# EAGLE design sa-22c-microsemi-connector (EAGLE 9.5.2)
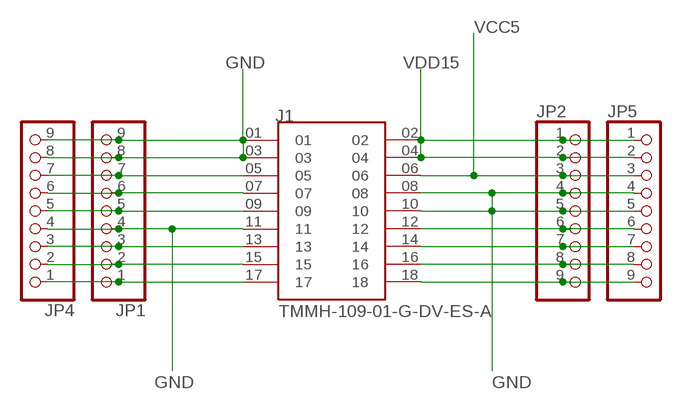
[diagram p0: schematic, sheet 1]

## Parts
J1  TMMH-109-01-G-DV-ES-A  [SAMTEC_TMMH-109-01-G-DV-ES-A]
JP1  PINHD-1X9  [1X09]
JP2  PINHD-1X9  [1X09]
JP4  PINHD-1X9  [1X09]
JP5  PINHD-1X9  [1X09]

## Nets
GND: J1.01 J1.03 J1.08 J1.10 J1.11 JP1.4 JP1.8 JP1.9 JP2.4 JP2.5 JP4.4 JP4.8 JP4.9 JP5.4 JP5.5
N$3: J1.05 JP1.7 JP4.7
N$4: J1.07 JP1.6 JP4.6
N$5: J1.09 JP1.5 JP4.5
N$7: J1.13 JP1.3 JP4.3
N$8: J1.15 JP1.2 JP4.2
N$9: J1.17 JP1.1 JP4.1
N$15: J1.12 JP2.6 JP5.6
N$16: J1.14 JP2.7 JP5.7
N$17: J1.16 JP2.8 JP5.8
N$18: J1.18 JP2.9 JP5.9
VCC5: J1.06 JP2.3 JP5.3
VDD15: J1.02 J1.04 JP2.1 JP2.2 JP5.1 JP5.2

## Library data of the parts
J1 = TMMH-109-01-G-DV-ES-A:TMMH-109-01-G-DV-ES-A; MANUFACTURER: Samtec; PARTREV: R; STANDARD: Manufacturer Recommendations
JP1 JP2 JP4 JP5 = pinhead:PINHD-1X9: PIN HEADER

## Board
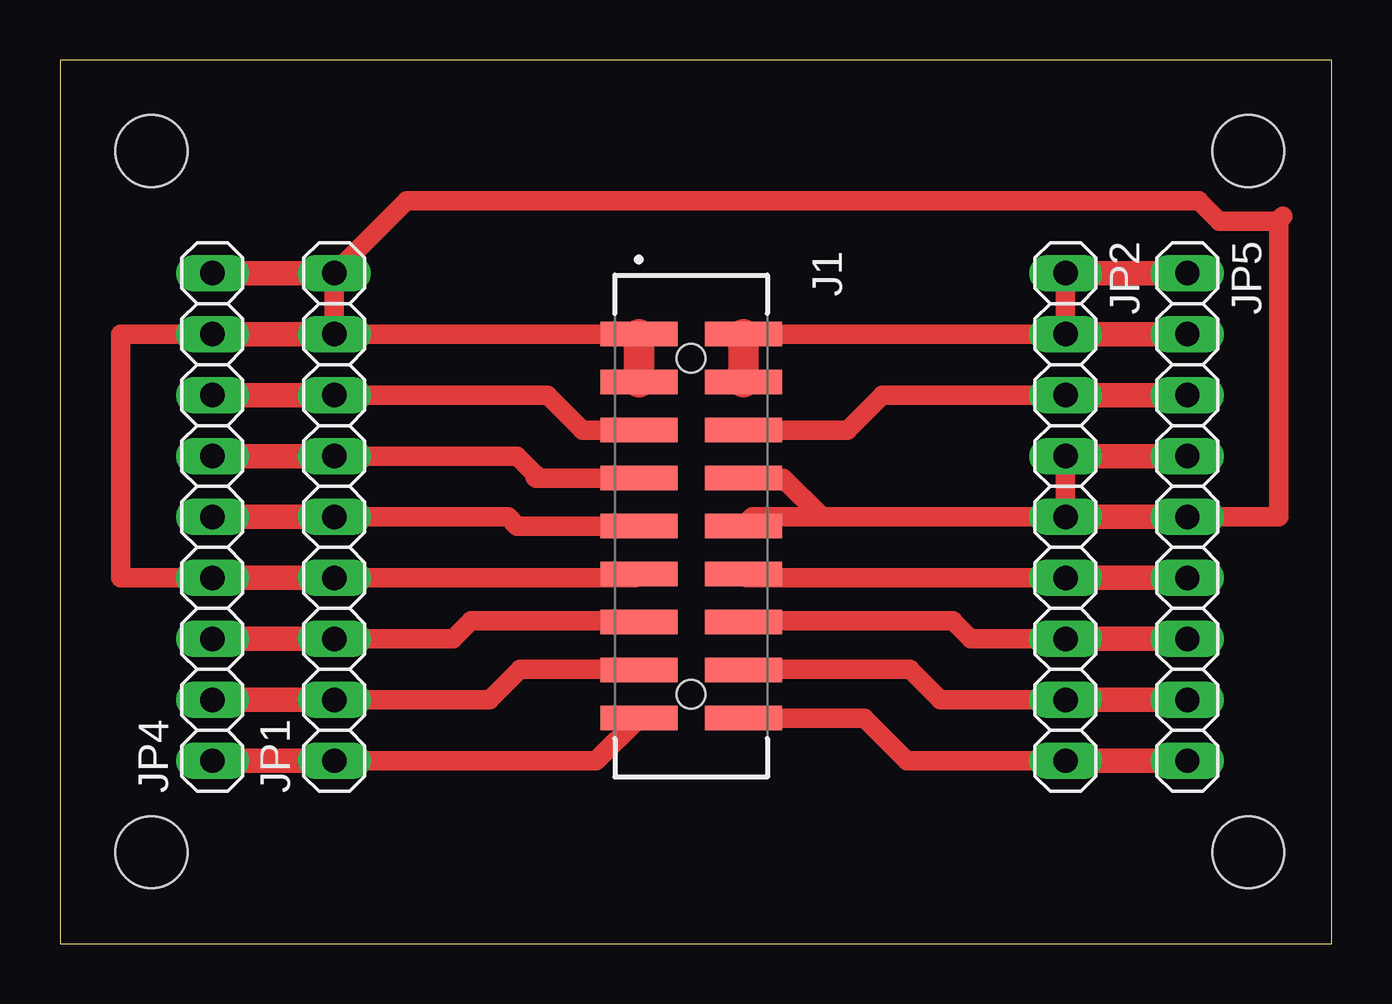
[diagram p1: board, top side]

Size 53.01 x 36.82 mm. Coordinates in mm from the lower left corner, seen from the top.
Outline: 0,0 53.01,0 53.01,36.82 0,36.82 0,0
Copper layers (1*16): Top 0.035mm / dielectric 1.5mm / Bottom 0.035mm
Design rules "default": minimum track width 6mil, minimum drill 0.35mm, track to track 6mil, track to pad 6mil, pad to pad 6mil, via to via 6mil, smd to smd 6mil, copper to edge 40mil, drill to drill 6mil, minimum pad ring 10mil, minimum via ring 8mil, stop-mask expansion 4mil, vias tented up to drill 0mil, thermal gap 10mil
Holes 3 mm at 3.81,33.02 3.81,3.81 49.53,33.02 49.53,3.81

### Footprints (pad centres in the part's own frame; a part is rotated, then mirrored left to right if it is on the bottom)
SAMTEC_TMMH-109-01-G-DV-ES-A = smd 1.016 x 3.21: 01 0,0; 02 0,4.354; 03 2,0; 04 2,4.354; 05 4,0; 06 4,4.354; 07 6,0; 08 6,4.354; 09 8,0; 10 8,4.354; 11 10,0; 12 10,4.354; 13 12,0; 14 12,4.354; 15 14,0; 16 14,4.354; 17 16,0; 18 16,4.354 | hole 1.19: 1,2.177; 15,2.177
1X09 = drill 1.016 long: 1 -10.16,0; 2 -7.62,0; 3 -5.08,0; 4 -2.54,0; 5 0,0; 6 2.54,0; 7 5.08,0; 8 7.62,0; 9 10.16,0

### Placement (x,y rotation side)
J1  24.13,25.4 270 top
JP1  11.43,17.78 90 top
JP2  41.91,17.78 270 top
JP4  6.35,17.78 90 top
JP5  46.99,17.78 270 top

### Tracks (layer width: path | path; a pad name or v marks a point on that pad's centre or on a via)
GND
  Top 0.813: J1.01 JP1.8 JP1.9 14.44,30.95 47.46,30.95 48.32,30.1 50.74,30.1 50.8,30.16 | J1.10 28.86,17.78 31.75,17.78 | 31.75,17.78 JP2.5 JP2.4 | J1.08 30.13,19.4 31.75,17.78 | JP4.4 2.54,15.24 2.54,25.4 JP4.8 | 50.8,30.16 50.8,17.78 JP5.5 | 50.8,30.16 50.96,30.32 | J1.11 23.97,15.24 JP1.4
  Top 1.016: JP4.9 JP1.9 12.19,27.94 | JP4.8 JP1.8 12.19,25.4 | JP2.4 JP5.4 47.75,20.32 | JP2.5 JP5.5 47.75,17.78 | JP1.4 JP4.4
  Top 1.27: J1.03 J1.01
N$3
  Top 0.813: J1.05 21.78,21.4 20.32,22.86 JP1.7
  Top 1.016: JP1.7 JP4.7
N$4
  Top 0.813: JP1.6 19.05,20.32 19.81,19.56 19.81,19.43 19.84,19.4 J1.07
  Top 1.016: JP1.6 JP4.6
N$5
  Top 0.813: J1.09 19.05,17.4 18.67,17.78 JP1.5
  Top 1.016: JP1.5 JP4.5
N$7
  Top 0.813: J1.13 24.07,13.46 17.14,13.46 16.38,12.7 JP1.3
  Top 1.016: JP1.3 JP4.3
N$8
  Top 0.813: J1.15 24.1,11.43 19.18,11.43 17.91,10.16 JP1.2
  Top 1.016: JP1.2 JP4.2
N$9
  Top 0.813: J1.17 22.35,7.62 JP1.1
  Top 1.016: JP1.1 JP4.1
N$15
  Top 0.813: JP2.6 28.64,15.24 J1.12
  Top 1.016: JP5.6 JP2.6
N$16
  Top 0.813: J1.14 28.55,13.46 37.21,13.46 37.97,12.7 JP2.7
  Top 1.016: JP5.7 JP2.7
N$17
  Top 0.813: J1.16 28.51,11.43 35.43,11.43 36.7,10.16 JP2.8
  Top 1.016: JP5.8 JP2.8
N$18
  Top 0.813: J1.18 33.53,9.4 35.31,7.62 JP2.9
  Top 1.016: JP5.9 JP2.9
VCC5
  Top 0.813: J1.06 32.83,21.4 34.29,22.86 JP2.3
  Top 1.016: JP5.3 JP2.3
VDD15
  Top 0.813: J1.02 JP2.2 JP2.1
  Top 1.016: JP5.2 JP2.2 | JP5.1 JP2.1
  Top 1.27: J1.04 J1.02